# Altium schematic sheet MolkkyV2.SchDoc
size A4
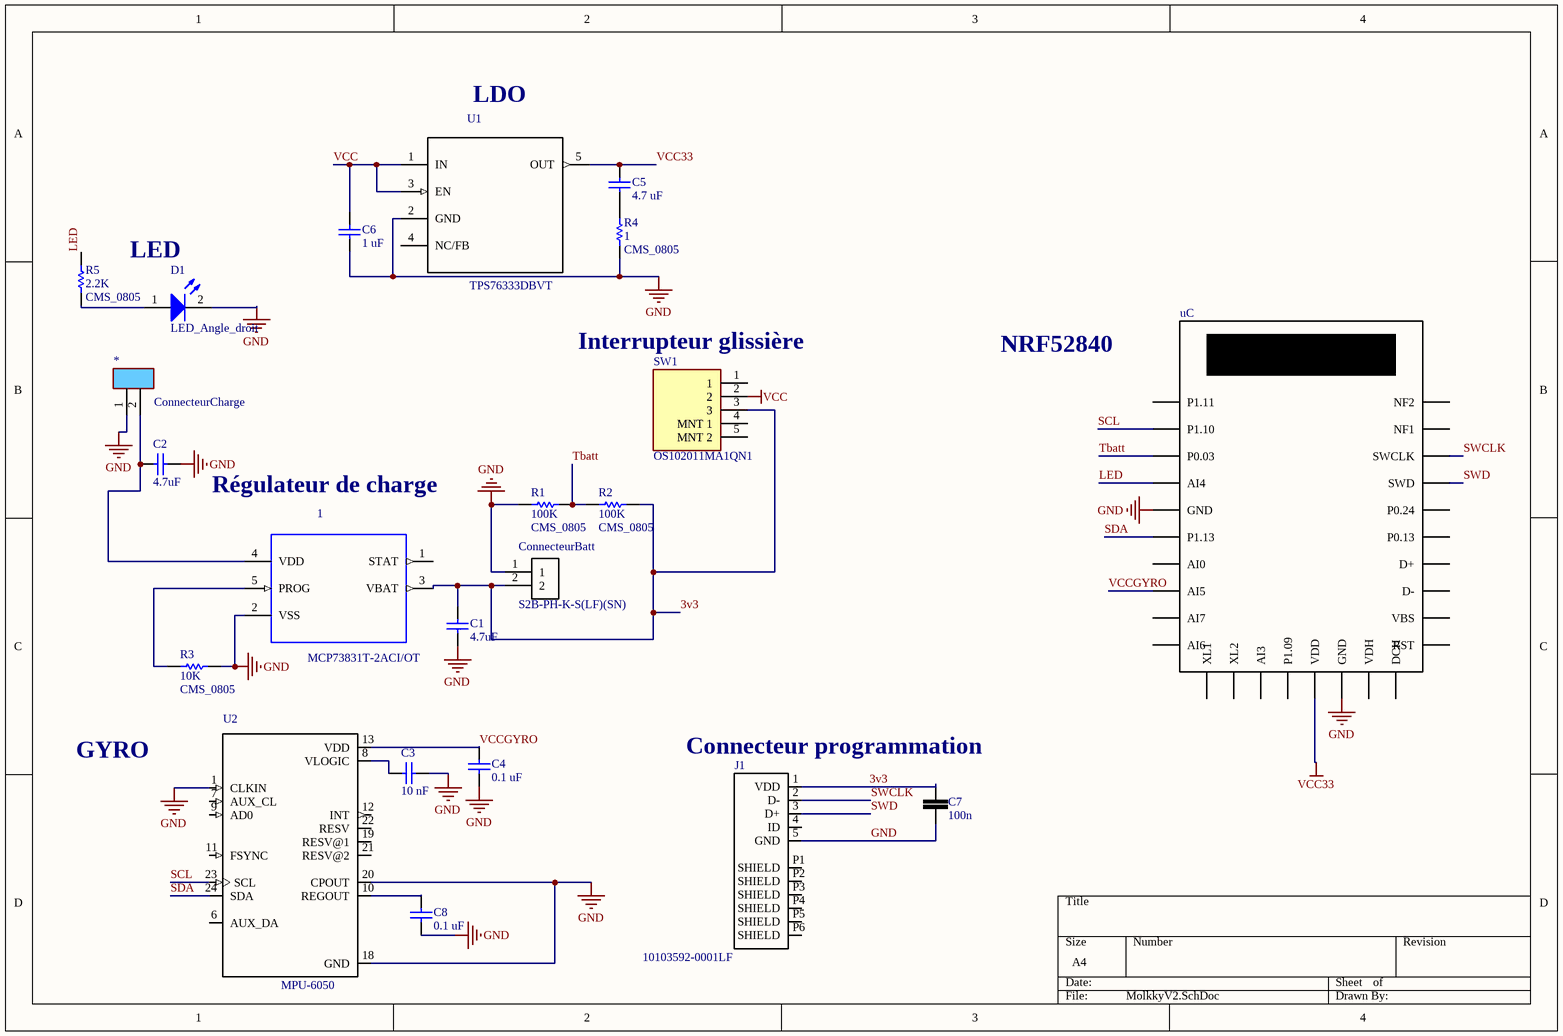
[diagram p0: MolkkyV2.SchDoc]

## Parts
1  MCP73831T-2ACI/OT  [*SOT95P280X145-5N]
*  ConnecteurCharge  [BARRETTE 2]
C1  value 4.7uF  [CONDENSATEUR_CMS_0805]  (hidden comment: CMS_0805)
C2  value 4.7uF  [CONDENSATEUR_CMS_0805]  (hidden comment: CMS_0805)
C3  value 10 nF  [CONDENSATEUR_CMS_0805]  (hidden comment: CMS_0805)
C4  value 0.1 uF  [CONDENSATEUR_CMS_0805]  (hidden comment: CMS_0805)
C5  value 4.7 uF  [CONDENSATEUR_CMS_0805]  (hidden comment: CMS_0805)
C6  value 1 uF  [CONDENSATEUR_CMS_0805]  (hidden comment: CMS_0805)
C7  100n  [CAPC2013X100N-0805-NoOverlay]
C8  value 0.1 uF  [CONDENSATEUR_CMS_0805]  (hidden comment: CMS_0805)
ConnecteurBatt  S2B-PH-K-S(LF)(SN)  [*JST_S2B-PH-K-S(LF)(SN)]
D1  LED_3MM  [LED_Angle_droit]  (value not drawn)
J1  10103592-0001LF  [*AMPHENOL_10103592-0001LF_10103592-0001LF(Primary)]
R1  value 100K  Type: CMS_0805  [RESISTANCE_CMS_0805]  (hidden comment: RESISTANCE_CMS_0805)
R2  value 100K  Type: CMS_0805  [RESISTANCE_CMS_0805]  (hidden comment: RESISTANCE_CMS_0805)
R3  value 10K  Type: CMS_0805  [RESISTANCE_CMS_0805]  (hidden comment: RESISTANCE_CMS_0805)
R4  value 1  Type: CMS_0805  [RESISTANCE_CMS_0805]  (hidden comment: RESISTANCE_CMS_0805)
R5  value 2.2K  Type: CMS_0805  [RESISTANCE_CMS_0805]  (hidden comment: RESISTANCE_CMS_0805)
SW1  Part Number: OS102011MA1QN1  [C&K_OS102011MA1QN1_0]  (hidden comment: Switch_C&K_OS102011MA1QN1_eec)
U1  TPS76333DBVT  [*SOT95P280X145-5N]
U2  MPU-6050  [*QFN50P400X400X95-24N]
uC  NRF52840 kit  [uC_NRF52840]  (value not drawn)

## Nets
GND: 1.2(VSS) *.1 C1.1 C2.1 C3.2 C4.2 C6.2 C7.1 C8.2 ConnecteurBatt.1 D1.2 J1.5(GND) R1.1 R3.2 R4.1 U1.2(GND) U2.1(CLKIN) U2.18(GND) U2.20(CPOUT) uC.5(GND) uC.16(GND)
VCC: C6.1 SW1.2 U1.1(IN) U1.3(EN)
VCC33: C5.1 U1.5(OUT) uC.15(VDD)
3v3: 1.3(VBAT) C1.2 C7.2 ConnecteurBatt.2 J1.1(VDD) R2.2 SW1.3
LED: R5.2 uC.4(AI4)
SCL: U2.23(SCL) uC.2(P1.10)
SDA: U2.24(SDA) uC.6(P1.13)
SWCLK: J1.2(D-) uC.28(SWCLK)
SWD: J1.3(D+) uC.27(SWD)
Tbatt: R1.2 R2.1 uC.3(P0.03)
VCCGYRO: C4.1 U2.13(VDD) uC.8(AI5)
Net1_4: 1.4(VDD) *.2 C2.2
Net1_5: 1.5(PROG) R3.1
NetC3_1: C3.1 U2.8(VLOGIC)
NetC5_2: C5.2 R4.2
NetC8_1: C8.1 U2.10(REGOUT)
NetD1_1: D1.1 R5.1

Not connected (* = marked no-connect by the designer): 1 1(STAT); J1 4(ID) P1(SHIELD) P2(SHIELD) P3(SHIELD) P4(SHIELD) P5(SHIELD) P6(SHIELD); SW1 1 4(MNT_1) 5(MNT_2); U1 4(NC/FB); U2 6(AUX_DA) 7(AUX_CL) 9(AD0) 11(FSYNC) 12(INT) 19(RESV@1) 21(RESV@2) 22(RESV); uC 1(P1.11) 7(AI0) 9(AI7) 10(AI6) 11(XL1) 12(XL2) 13(AI3) 14(P1.09) 17(VDH) 18(DCH) 21(RST) 22(VBS) 23(D-) 24(D+) 25(P0.13) 26(P0.24) 29(NF1) 30(NF2)

## Notes on the sheet
- LDO
- LED
- (near SW1) Interrupteur glissière
- NRF52840
- Régulateur de charge
- GYRO
- Connecteur programmation

## Library data of the parts
1 = MCP73831T-2ACI/OT: MCP73831 Series Single-Cell Li-Ion/Li-Polymer Battery Charge Controller SOT-23-5; MF: Microchip; MP: MCP73831T-2ACI/OT; Package: SOT-23 Microchip; Price: None; Availability: Unavailable; SnapEDA_Link: https://www.snapeda.com/parts/MCP73831T-2ACI/OT/Microchip/view-part/?ref=snap; Value: *
* = Barrette 2
C1-C6 C8 = CONDENSATEUR_CMS_CER_0805: CONDENSATEUR CMS CERAMIQUE 0805
C7 = 0100000001868: Manufacturer: Yageo; Manufacturer Part Number: CC0805KRX7R9BB104; id: 136; Assembly: SMD; Temperature Coefficient: X7R; Tolerance: 10%; Voltage Rated: 50; item_id: 450; Recommended Rating: Platinum; Barcode: 0100000001868; Category: Capacitors; Capacitance: 100n; Package Case: 0805; Family: CERAMIC CAPACITOR; Part Type: Capacitors
ConnecteurBatt = S2B-PH-K-S(LF)(SN): PH Series 2 Position 2.0 mm Through Hole Side Entry Shrouded Header; MP: S2B-PH-K-S_LF__SN_; MF: JST Sales; Price: None; Package: None; SnapEDA_Link: https://www.snapeda.com/parts/S2B-PH-K-S%28LF%29%28SN%29/JST%20Sales%20America%20Inc./view-part/?ref=snap; Availability: Unavailable; Value: *
D1 = LED Angle droit: LED Angle droit - ROUGE; Type: LED_Angle_droit
J1 = 10103592-0001LF: Micro Usb, 2.0 Type b, Rcpt, Smt; MF: Amphenol ICC; Package: None; Availability: Unavailable; SnapEDA_Link: https://www.snapeda.com/parts/10103592-0001LF/Amphenol%20ICC/view-part/?ref=snap; Price: None; MP: 10103592-0001LF; Value: *
R1-R5 = RESISTANCE_CMS_0805: RESISTANCE CMS 0805
SW1 = Switch_C&K_OS102011MA1QN1_eec: SWITCH SLIDE SPDT 100MA 12V; Manufacturer: C&K; helpURL: https://upverter.com/upn/revision/2b2ed0fd4d150582/; ComponentLink2Description: Datasheet; Temperature: -30°C to +70°C; Package: SW_SLIDE; Supplier 2: Mouser; Price: 0.290275964971; Supplier 1: Digi-Key; ComponentLink1URL: https://upverter.com/upn/revision/2b2ed0fd4d150582/; Supplier Part Number 2: OS102011MA1QN1; Supplier Part Number 1: CKN9559-ND; ComponentLink1Description: Upverter; ComponentLink2URL: https://www.ckswitches.com/media/1428/os.pdf; RoHS: TRUE; Mouser Part Number: OS102011MA1QN1; Temperature Range High: +70°C; Digikey Description: SWITCH SLIDE SPDT 100MA 12V; Digikey Part Number: CKN9559-ND; Lead Free: yes; Temperature Range Low: -30°C
U1 = TPS76333DBVT: LDO voltage regulator [Texas Instruments] TPS76333DBVT LDO voltage regulator; Package: SOT-23-5 Texas Instruments; MF: Texas Instruments; Availability: Unavailable; SnapEDA_Link: https://www.snapeda.com/parts/TPS76333DBVT/Texas%20Instruments/view-part/?ref=snap; Price: None; MP: TPS76333DBVT; Value: *
U2 = MPU-6050: 3-axis gyroscope, 3-axis accelerometer in a 4x4x0.9 housing; MF: TDK InvenSense; Price: None; SnapEDA_Link: https://www.snapeda.com/parts/MPU-6050/TDK%20InvenSense/view-part/?ref=snap; MP: MPU-6050; Package: QFN-24 InvenSense; Availability: Unavailable; Value: *
uC = NRF52840 kit: Supplier 1: TME; Supplier Part Number 1: NRF52840-QIAA-R